# Altium schematic sheet 33K_Transistor_Logic.SchDoc
size A4
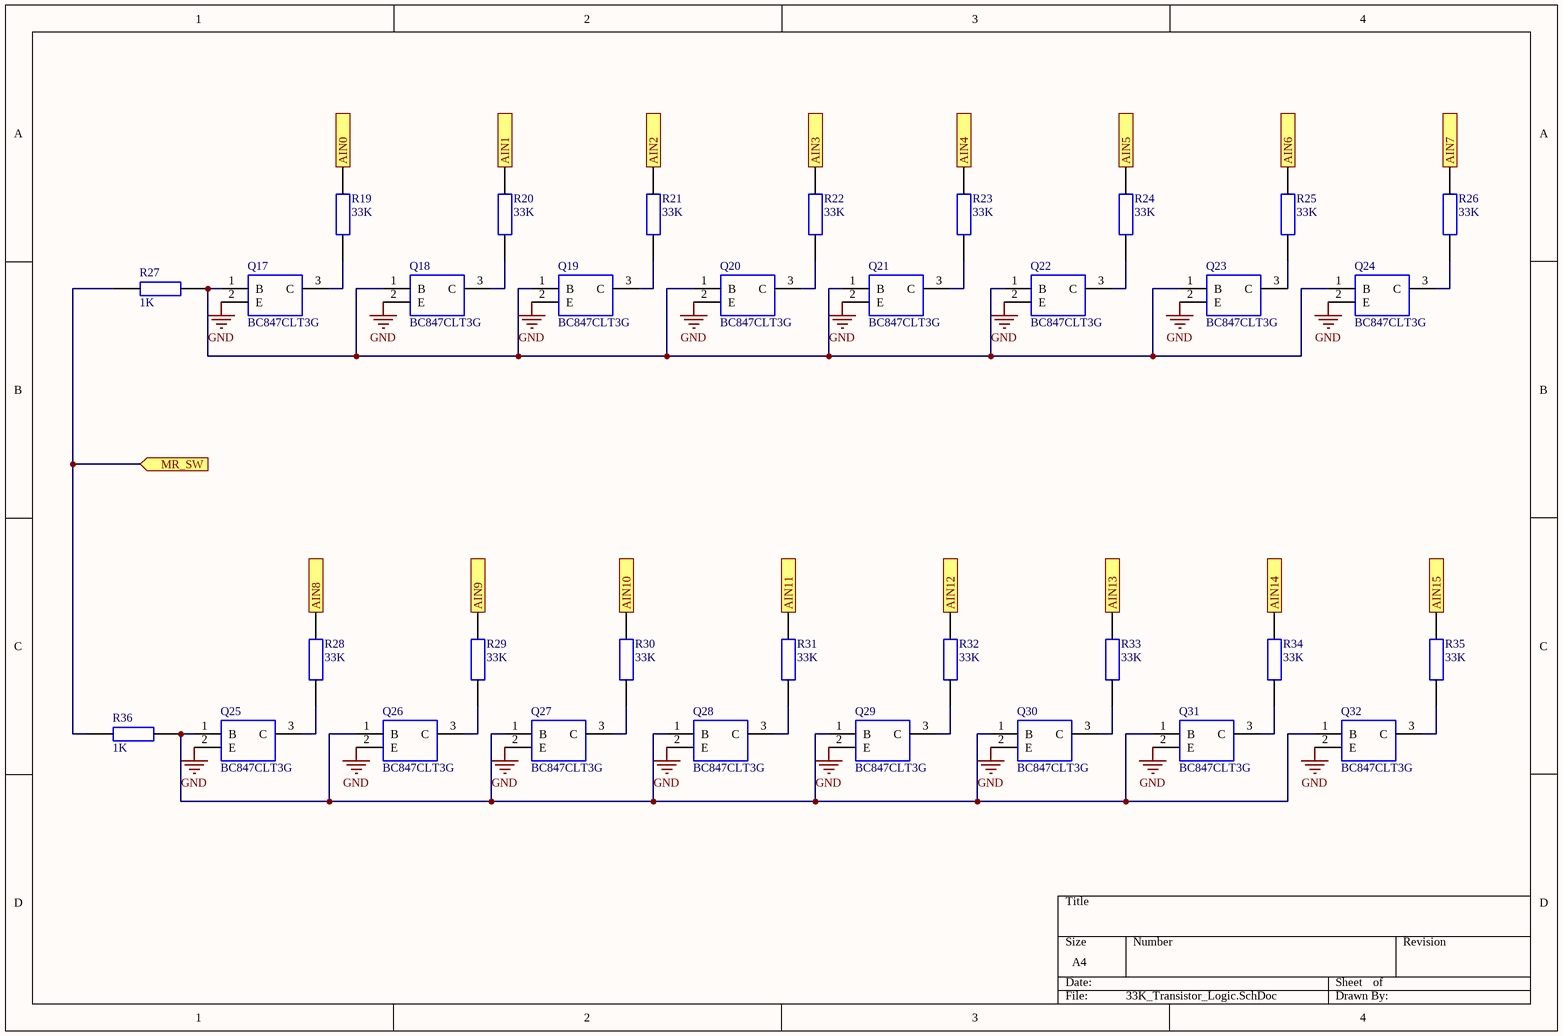
[diagram p0: 33K_Transistor_Logic.SchDoc]

## Parts
Q17  BC847CLT3G  [SOT96P237X111-3N]
Q18  BC847CLT3G  [SOT96P237X111-3N]
Q19  BC847CLT3G  [SOT96P237X111-3N]
Q20  BC847CLT3G  [SOT96P237X111-3N]
Q21  BC847CLT3G  [SOT96P237X111-3N]
Q22  BC847CLT3G  [SOT96P237X111-3N]
Q23  BC847CLT3G  [SOT96P237X111-3N]
Q24  BC847CLT3G  [SOT96P237X111-3N]
Q25  BC847CLT3G  [SOT96P237X111-3N]
Q26  BC847CLT3G  [SOT96P237X111-3N]
Q27  BC847CLT3G  [SOT96P237X111-3N]
Q28  BC847CLT3G  [SOT96P237X111-3N]
Q29  BC847CLT3G  [SOT96P237X111-3N]
Q30  BC847CLT3G  [SOT96P237X111-3N]
Q31  BC847CLT3G  [SOT96P237X111-3N]
Q32  BC847CLT3G  [SOT96P237X111-3N]
R19  33K  [RESC1608X55N]
R20  33K  [RESC1608X55N]
R21  33K  [RESC1608X55N]
R22  33K  [RESC1608X55N]
R23  33K  [RESC1608X55N]
R24  33K  [RESC1608X55N]
R25  33K  [RESC1608X55N]
R26  33K  [RESC1608X55N]
R27  1K  [RESC1608X55N]
R28  33K  [RESC1608X55N]
R29  33K  [RESC1608X55N]
R30  33K  [RESC1608X55N]
R31  33K  [RESC1608X55N]
R32  33K  [RESC1608X55N]
R33  33K  [RESC1608X55N]
R34  33K  [RESC1608X55N]
R35  33K  [RESC1608X55N]
R36  1K  [RESC1608X55N]

## Ports
AIN0 (out), AIN1 (out), AIN2 (out), AIN3 (out), AIN4 (out), AIN5 (out), AIN6 (out), AIN7 (out), AIN8 (out), AIN9 (out), AIN10 (out), AIN11 (out), AIN12 (out), AIN13 (out), AIN14 (out), AIN15 (out), MR_SW (in)

## Nets
GND: Q17.2(E) Q18.2(E) Q19.2(E) Q20.2(E) Q21.2(E) Q22.2(E) Q23.2(E) Q24.2(E) Q25.2(E) Q26.2(E) Q27.2(E) Q28.2(E) Q29.2(E) Q30.2(E) Q31.2(E) Q32.2(E)
AIN0: R19.2 ; port AIN0
AIN1: R20.2 ; port AIN1
AIN2: R21.2 ; port AIN2
AIN3: R22.2 ; port AIN3
AIN4: R23.2 ; port AIN4
AIN5: R24.2 ; port AIN5
AIN6: R25.2 ; port AIN6
AIN7: R26.2 ; port AIN7
AIN8: R28.2 ; port AIN8
AIN9: R29.2 ; port AIN9
AIN10: R30.2 ; port AIN10
AIN11: R31.2 ; port AIN11
AIN12: R32.2 ; port AIN12
AIN13: R33.2 ; port AIN13
AIN14: R34.2 ; port AIN14
AIN15: R35.2 ; port AIN15
MR_SW: R27.1 R36.1 ; port MR_SW
NetQ17_1: Q17.1(B) Q18.1(B) Q19.1(B) Q20.1(B) Q21.1(B) Q22.1(B) Q23.1(B) Q24.1(B) R27.2
NetQ17_3: Q17.3(C) R19.1
NetQ18_3: Q18.3(C) R20.1
NetQ19_3: Q19.3(C) R21.1
NetQ20_3: Q20.3(C) R22.1
NetQ21_3: Q21.3(C) R23.1
NetQ22_3: Q22.3(C) R24.1
NetQ23_3: Q23.3(C) R25.1
NetQ24_3: Q24.3(C) R26.1
NetQ25_1: Q25.1(B) Q26.1(B) Q27.1(B) Q28.1(B) Q29.1(B) Q30.1(B) Q31.1(B) Q32.1(B) R36.2
NetQ25_3: Q25.3(C) R28.1
NetQ26_3: Q26.3(C) R29.1
NetQ27_3: Q27.3(C) R30.1
NetQ28_3: Q28.3(C) R31.1
NetQ29_3: Q29.3(C) R32.1
NetQ30_3: Q30.3(C) R33.1
NetQ31_3: Q31.3(C) R34.1
NetQ32_3: Q32.3(C) R35.1

## Library data of the parts
Q17-Q32 = BC847CLT3G: Manufacturer_Name: ON Semiconductor; Geometry.Height: 1.11mm; Manufacturer_Part_Number: BC847CLT3G; Arrow Part Number: BC847CLT3G; Arrow Price/Stock: https://www.arrow.com/en/products/bc847clt3g/on-semiconductor; Mouser Part Number: 863-BC847CLT3G; Mouser Price/Stock: https://www.mouser.co.uk/ProductDetail/ON-Semiconductor/BC847CLT3G?qs=vNc2DXHODiIVMr372epecQ%3D%3D; Datasheet Link: http://www.onsemi.com/pub/Collateral/BC846ALT1-D.PDF
R19-R26 R28-R35 = RC0603FR-07330RL: YAGEO (PHYCOMP) - RC0603FR-07330RL - RES, THICK FILM, 330R, 1%, 0.1W, 0603; Geometry.Height: 0.55mm; Manufacturer_Name: YAGEO (PHYCOMP); Manufacturer_Part_Number: RC0603FR-07330RL; Arrow Part Number: RC0603FR-07330RL; Arrow Price/Stock: https://www.arrow.com/en/products/rc0603fr-07330rl/yageo; Mouser Part Number: 603-RC0603FR-07330RL; Mouser Price/Stock: https://www.mouser.co.uk/ProductDetail/Yageo/RC0603FR-07330RL?qs=diQw95jMAeN1335dAOzMfg%3D%3D; Datasheet Link: http://www.yageo.com/documents/recent/PYu-RC0603_51_RoHS_L_v5.pdf
R27 R36 = RC0603JR-071KL: YAGEO (PHYCOMP) - RC0603JR-071KL - RES, THICK FILM, 1K, 5%, 0.1W, 0603; Geometry.Height: 0.55mm; Manufacturer_Name: YAGEO (PHYCOMP); Manufacturer_Part_Number: RC0603JR-071KL; Arrow Part Number: RC0603JR-071KL; Arrow Price/Stock: https://www.arrow.com/en/products/rc0603jr-071kl/yageo; Mouser Part Number: 603-RC0603JR-071KL; Mouser Price/Stock: https://www.mouser.co.uk/ProductDetail/Yageo/RC0603JR-071KL?qs=%2F9ZTgpVJnN7bctK4R%2FDEoA%3D%3D; Datasheet Link: http://www.yageo.com/documents/recent/PYu-RC0603_51_RoHS_L_v5.pdf